# EAGLE design usbmass.1 (EAGLE 5.06)
PIN1: SCLK
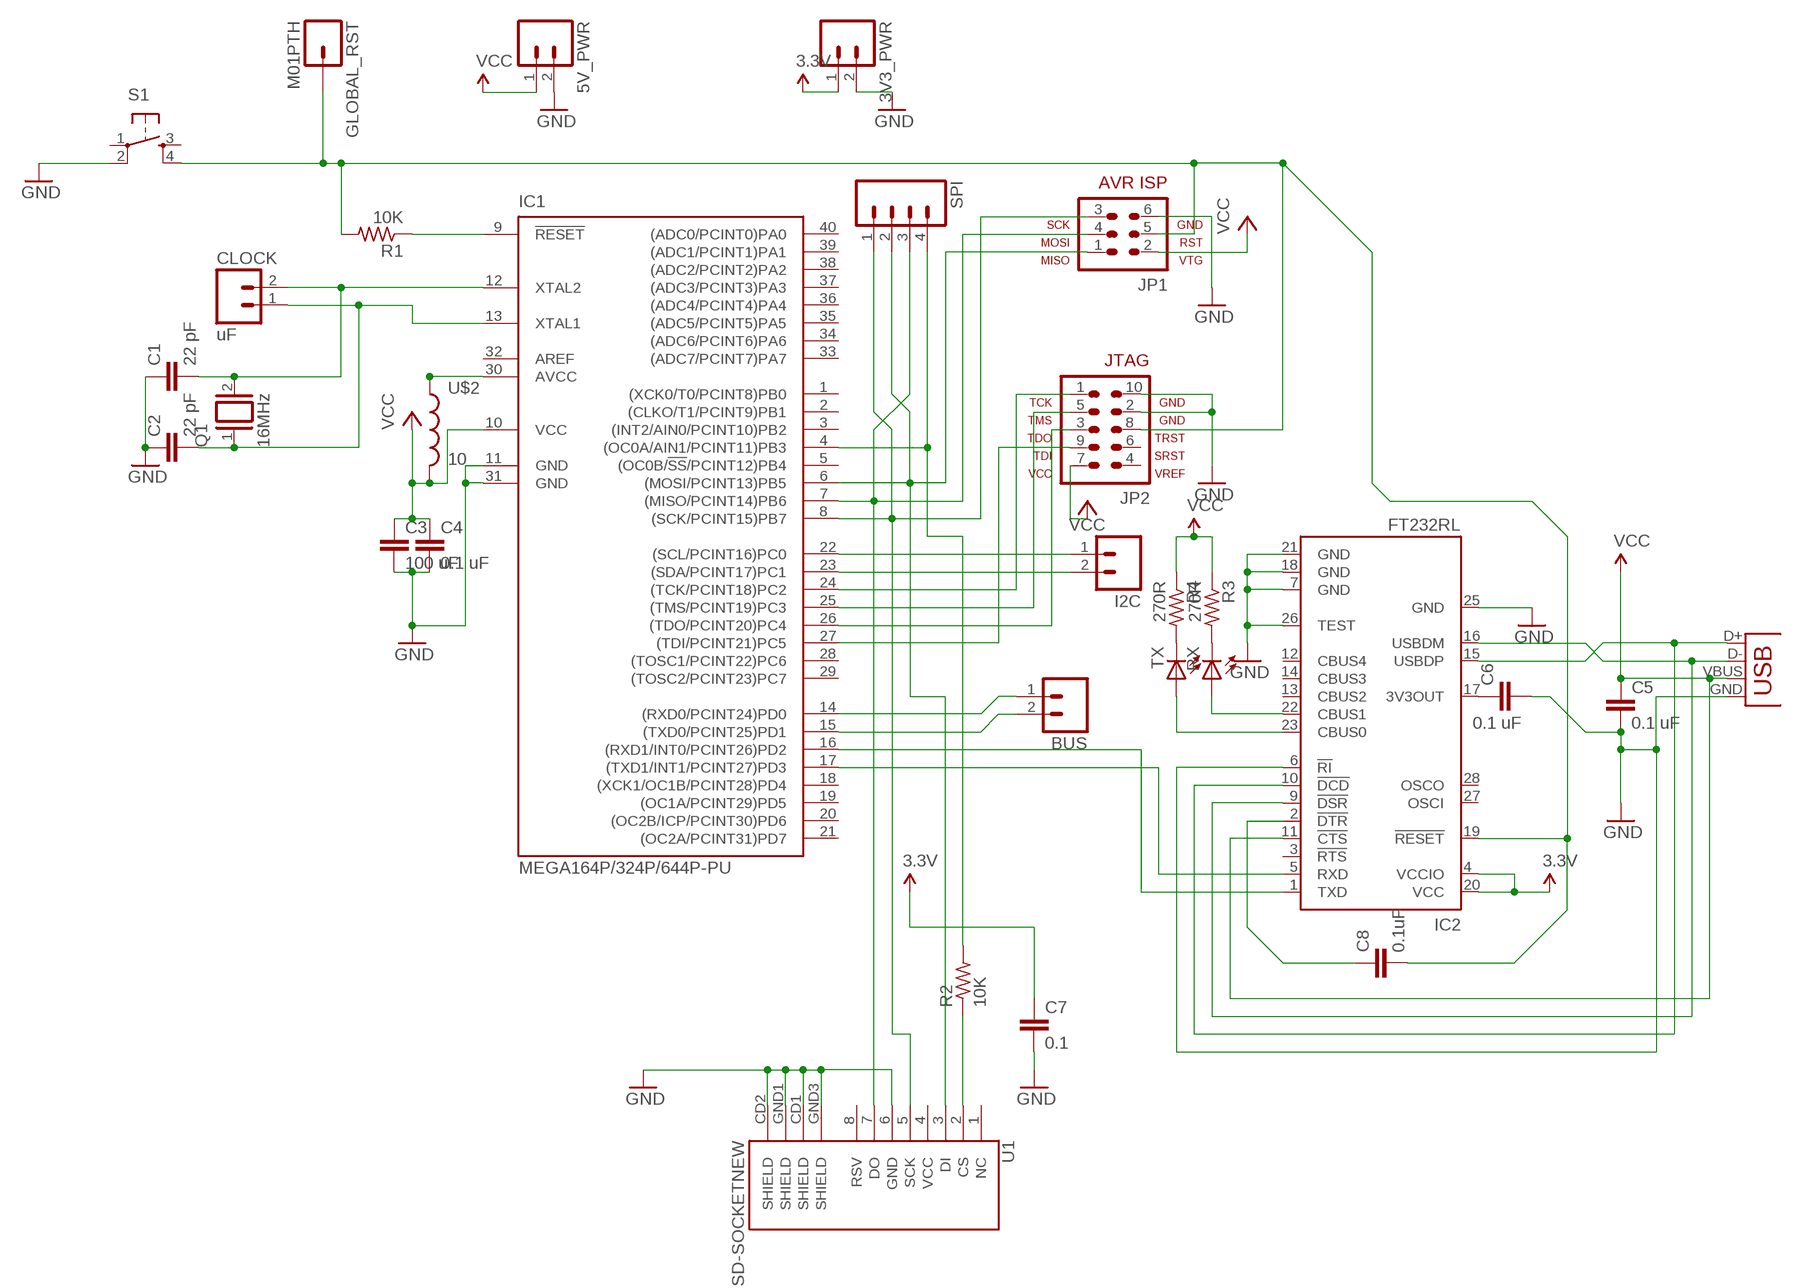
[diagram p0: schematic, sheet 1]

## Parts
3V3_PWR  M02  [1X02_LONGPADS]
5V_PWR  M02  [1X02_LONGPADS]
BUS  M02  [1X02_LONGPADS]
C1  22 pF  CAP0603-CAP  [0603-CAP]
C2  22 pF  CAP0603-CAP  [0603-CAP]
C3  100 uF  CAP0603-CAP  [0603-CAP]
C4  0.1 uF  CAP0603-CAP  [0603-CAP]
C5  0.1 uF  CAP0603-CAP  [0603-CAP]
C6  0.1 uF  CAP0603-CAP  [0603-CAP]
C7  0.1  CAP0603-CAP  [0603-CAP]
C8  0.1uF  CAP0603-CAP  [0603-CAP]
CLOCK  uF  M02PTH  [1X02]
GLOBAL_RST  M01PTH  [1X01]
I2C  M02LOCK  [1X02_LOCK]
IC1  MEGA164P/324P/644P-PU  [DIL40]
IC2  FT232RL  [SSOP28]
JP1  AVR-ISP-6  [AVR-ISP-6]
JP2  AVR-JTAG-10  [AVR-JTAG-10]
Q1  16MHz  XTAL  [Q]
R1  10K  R-US_R0603  [R0603]
R2  10K  R-US_R0603  [R0603]
R3  270R  R-US_R0603  [R0603]
R4  270R  R-US_R0603  [R0603]
RX  LED0603  [LED-0603]
S1  TAC_SWITCHSMD  [TACTILE_SWITCH_SMD]
SPI  M04LOCK  [1X04_LOCK]
TX  LED0603  [LED-0603]
U1  USD-SOCKETNEW  [MICRO-SD-SOCKET-PP]
U$2  10  INDUCTOR0603  [0603]
X1  USBSMD  [USB-MINIB]

## Nets
3.3V: 3V3_PWR.1 C7.1 IC2.4(VCCIO) IC2.20(VCC)
GND: 3V3_PWR.2 5V_PWR.2 C1.1 C2.1 C3.2 C4.2 C5.2 C6.2 C7.2 IC1.11(GND) IC1.31(GND) IC2.6(!RI) IC2.7(GND) IC2.18(GND) IC2.21(GND) IC2.25(GND) IC2.26(TEST) JP1.6 JP2.2 JP2.10 S1.2 U1.6(GND) U1.CD1(SHIELD) U1.CD2(SHIELD) U1.GND1(SHIELD) U1.GND3(SHIELD) X1.GND
N$1: IC1.9(!RESET) R1.1
N$2: C8.2 GLOBAL_RST.1 IC2.19(!RESET) JP1.5 JP2.8 R1.2 S1.4
N$3: C2.2 CLOCK.1 IC1.13(XTAL1) Q1.1
N$4: C1.2 CLOCK.2 IC1.12(XTAL2) Q1.2
N$5: IC1.30(AVCC) U$2.1
N$6: IC1.25((TMS/PCINT19)PC3) JP2.5
N$7: IC1.8((SCK/PCINT15)PB7) JP1.3 SPI.1 U1.5(SCK)
N$8: IC1.7((MISO/PCINT14)PB6) JP1.4 SPI.3 U1.7(DO)
N$9: IC1.6((MOSI/PCINT13)PB5) JP1.1 SPI.2 U1.3(DI)
N$10: IC1.26((TDO/PCINT20)PC4) JP2.3
N$11: IC1.24((TCK/PCINT18)PC2) JP2.1
N$12: IC1.17((TXD1/INT1/PCINT27)PD3) IC2.5(RXD)
N$13: IC1.27((TDI/PCINT21)PC5) JP2.9
N$14: I2C.2 IC1.23((SDA/PCINT17)PC1)
N$15: IC1.4((OC0A/AIN1/PCINT11)PB3) R2.2 SPI.4
N$16: C6.1 IC2.17(3V3OUT)
N$17: IC1.16((RXD1/INT0/PCINT26)PD2) IC2.1(TXD)
N$18: IC2.9(!DSR) IC2.16(USBDM) X1.D-
N$19: IC2.10(!DCD) IC2.15(USBDP) X1.D+
N$20: IC2.23(CBUS0) TX.A
N$21: R2.1 U1.2(CS)
N$22: R4.2 TX.C
N$23: R3.2 RX.C
N$24: IC2.22(CBUS1) RX.A
N$25: BUS.2 IC1.15((TXD0/PCINT25)PD1)
N$26: BUS.1 IC1.14((RXD0/PCINT24)PD0)
N$27: I2C.1 IC1.22((SCL/PCINT16)PC0)
N$30: C8.1 IC2.2(!DTR)
VCC: 5V_PWR.1 C3.1 C4.1 C5.1 IC1.10(VCC) IC2.11(!CTS) JP1.2 JP2.7 R3.1 R4.1 U$2.2 X1.VBUS
Unconnected: IC1.1((XCK0/T0/PCINT8)PB0) IC1.2((CLKO/T1/PCINT9)PB1) IC1.3((INT2/AIN0/PCINT10)PB2) IC1.5((OC0B/!SS!/PCINT12)PB4) IC1.18((XCK1/OC1B/PCINT28)PD4) IC1.19((OC1A/PCINT29)PD5) IC1.20((OC2B/ICP/PCINT30)PD6) IC1.21((OC2A/PCINT31)PD7) IC1.28((TOSC1/PCINT22)PC6) IC1.29((TOSC2/PCINT23)PC7) IC1.33((ADC7/PCINT7)PA7) IC1.34((ADC6/PCINT6)PA6) IC1.35((ADC5/PCINT5)PA5) IC1.36((ADC4/PCINT4)PA4) IC1.37((ADC3/PCINT3)PA3) IC1.38((ADC2/PCINT2)PA2) IC1.39((ADC1/PCINT1)PA1) IC1.40((ADC0/PCINT0)PA0) IC2.3(!RTS) IC2.12(CBUS4) IC2.13(CBUS2) IC2.14(CBUS3) IC2.27(OSCI) IC2.28(OSCO) JP2.4 JP2.6 S1.1 S1.3 U1.1(NC) U1.4(VCC) U1.8(RSV)

## Power pins joined to a net without a drawn wire
AREF: IC1.32(AREF)

## Library data of the parts
3V3_PWR 5V_PWR BUS CLOCK I2C = SparkFun:M02: Header 2 Standard 2-pin 0.1" header. Use with straight break away headers (SKU : PRT-00116), right angle break away headers (PRT-00553), swiss pins (PRT-00743), machine pins (PRT-00117), and female headers (PRT-00115). Molex polarized connector foot print use with SKU : PRT-08233 with associated crimp pins and housings.
C1-C8 = SparkFun:CAP: Capacitor Standard 0603 ceramic capacitor, and 0.1" leaded capacitor.
GLOBAL_RST = SparkFun:M01: Header 1 Standard 1-pin 0.1" header. Use with straight break away headers (SKU : PRT-00116), right angle break away headers (PRT-00553), swiss pins (PRT-00743), machine pins (PRT-00117), and female headers (PRT-00115).
IC1 = avr-6:MEGA164P/324P/644P-PU
IC2 = ftdichip:FT232R: Source: http://www.ftdichip.com/Documents/DataSheets/DS_FT232R_v104.pdf
JP1 = avr-6:AVR-ISP-6: AVR ISP-6 Serial Programming Header
JP2 = avr-6:AVR-JTAG-10: AVR JTAG Debug/Programming Header
Q1 = special:XTAL: CRYSTAL
R1-R4 = resistor:R-US_: RESISTOR, American symbol
RX TX = SparkFun:LED: LEDs Standard schematic elements and footprints for 5mm, 3mm, 1206, and 0603 sized LEDs. 5mm - Spark Fun Electronics SKU : COM-00529 (and others)
S1 = SparkFun:TAC_SWITCH: Momentary Switch Button commonly used for reset or general input. Spark Fun Electronics SKU : COM-00097
SPI = SparkFun:M04: Header 4 Standard 4-pin 0.1" header. Use with straight break away headers (SKU : PRT-00116), right angle break away headers (PRT-00553), swiss pins (PRT-00743), machine pins (PRT-00117), and female headers (PRT-00115). Molex polarized connector foot print use with SKU : PRT-08231 with associated crimp pins and housings.
U1 = SparkFun:USD-SOCKET: microSD Socket Push-push type uSD socket. Schematic element and footprint production proven. Spark Fun Electronics SKU : PRT-00127. tDoc lines correctly indicate media card edge positions when inserting (unlocked, locked, depressed).
U$2 = SparkFun:INDUCTOR: Inductors Basic Inductor/Choke - 0603 and 1206. Footprints are not proven and vary greatly between part numbers.
X1 = SparkFun:USB: USB Connectors USB-B-PTH is fully proven SKU : PRT-00139 USB-miniB is fully proven SKU : PRT-00587 USB-A-PCB is untested. USB-A-H is throughly reviewed, but untested. Spark Fun Electronics SKU : PRT-00437 USB-B-SMT is throughly reviewed, but untested. Needs silkscreen touching up. USB-A-S has not been used/tested USB-MB-H has not been used/tested

## Board
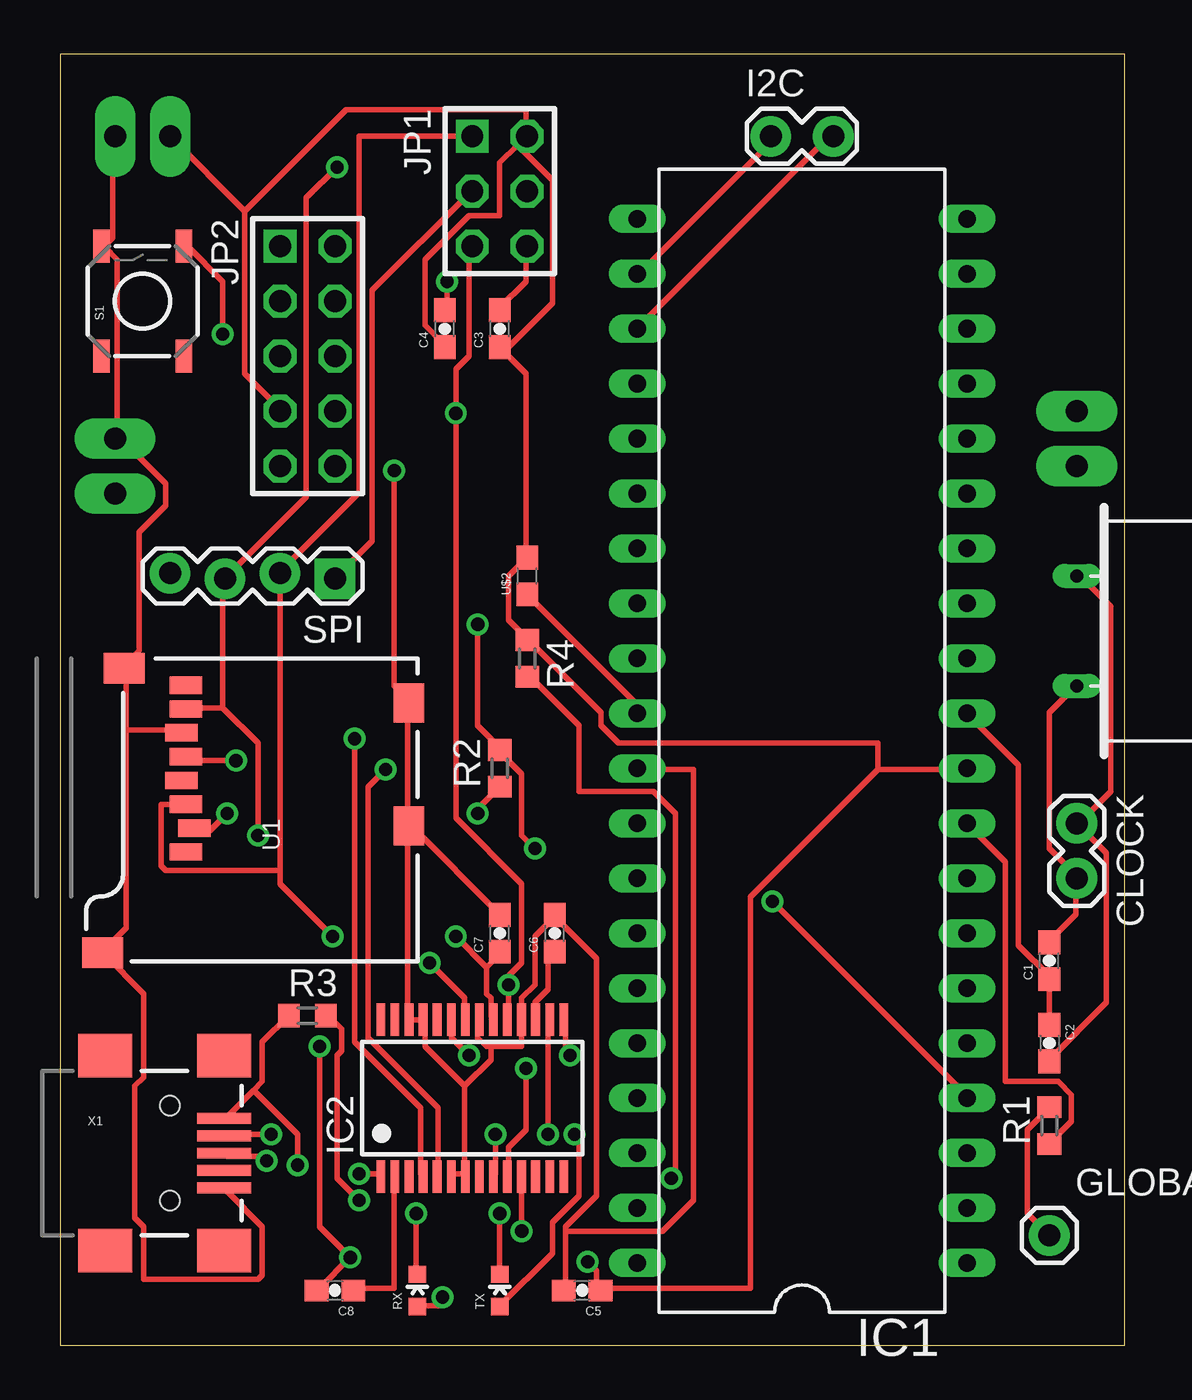
[diagram p1: board, top side]
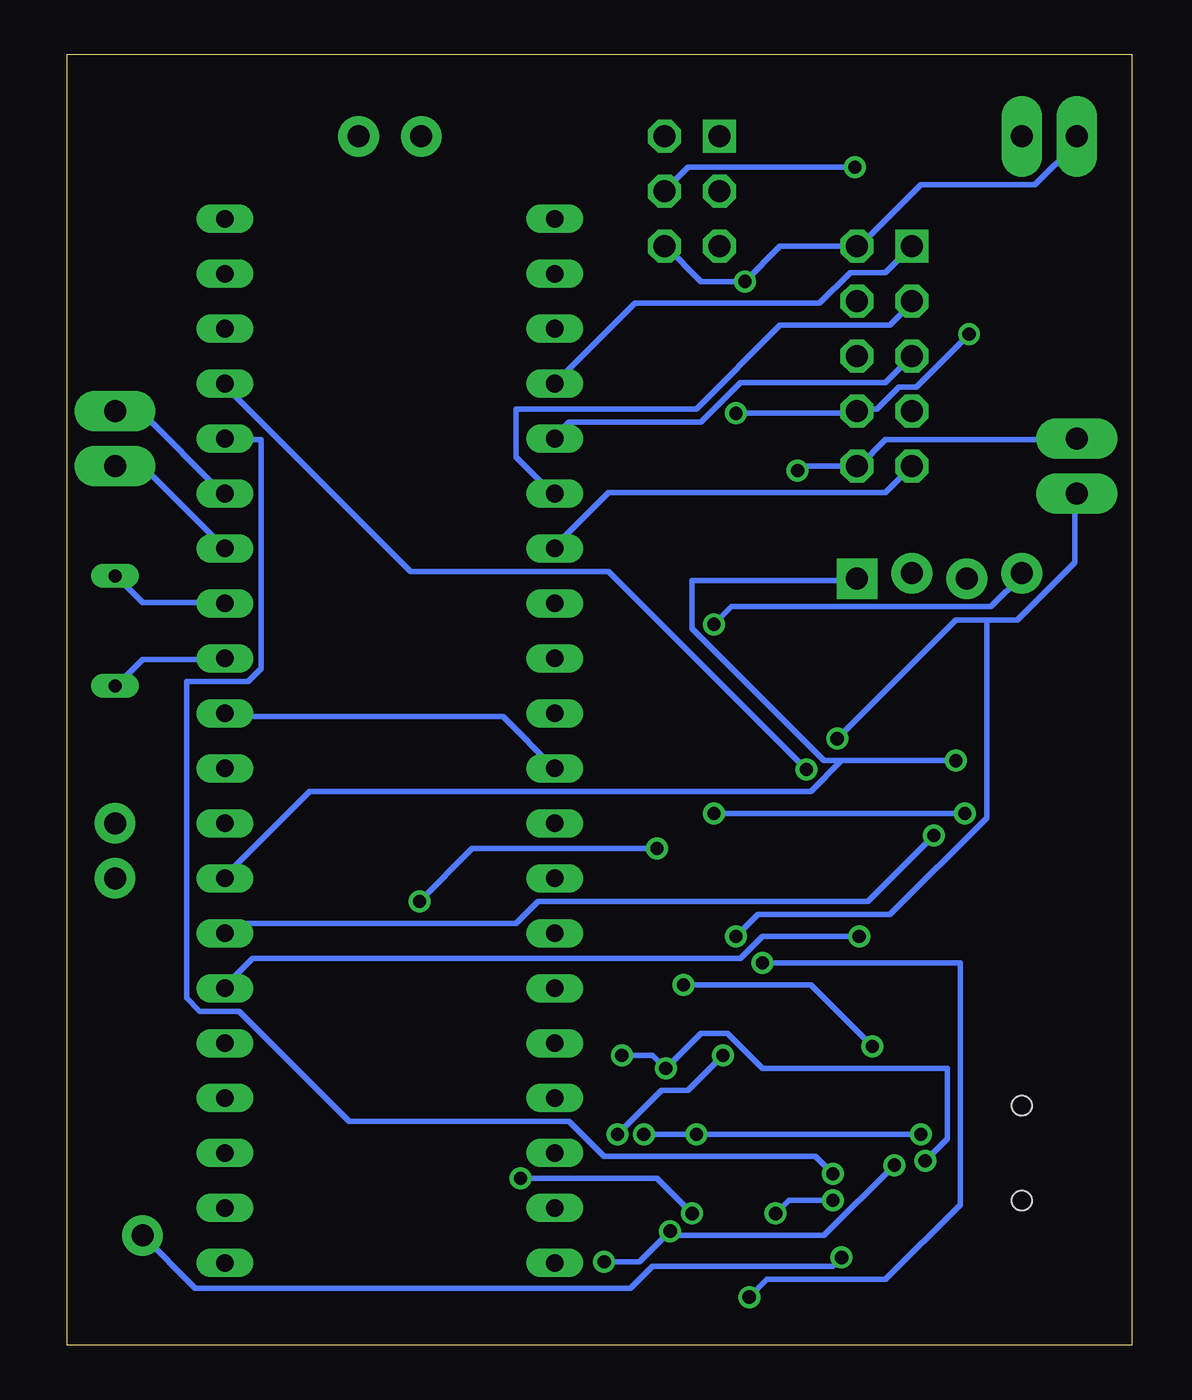
[diagram p2: board, bottom side, seen from below]

Size 49.2 x 59.68 mm. Coordinates in mm from the lower left corner, seen from the top.
Outline: 0,0 49.2,0 49.2,59.68 0,59.68 0,0
Copper layers (1*16): Top 0.035mm / dielectric 1.5mm / Bottom 0.035mm
Design rules "default": minimum track width 10mil, minimum drill 24mil, track to track 8mil, track to pad 8mil, pad to pad 8mil, via to via 8mil, smd to smd 8mil, copper to edge 40mil, drill to drill 8mil, minimum pad ring 10mil, minimum via ring 8mil, stop-mask expansion 4mil, vias tented up to drill 0mil, thermal gap 10mil

### Footprints (pad centres in the part's own frame; a part is rotated, then mirrored left to right if it is on the bottom)
1X02_LONGPADS = drill 1.016 pad 1.88 long: 1 0,0; 2 2.54,0
0603-CAP = smd 1.1 x 1: 1 -0.85,0; 2 0.85,0
1X02 = drill 1.016 pad 1.88 round: 1 0,0; 2 2.54,0
1X01 = drill 1.016 pad 1.88 round: 1 0,0
1X02_LOCK = drill 1.016 pad 1.88 round: 1 -0.178,0; 2 2.718,0
DIL40 = drill 0.813 long: 1 -24.13,-7.62; 2 -21.59,-7.62; 3 -19.05,-7.62; 4 -16.51,-7.62; 5 -13.97,-7.62; 6 -11.43,-7.62; 7 -8.89,-7.62; 8 -6.35,-7.62; 9 -3.81,-7.62; 10 -1.27,-7.62; 11 1.27,-7.62; 12 3.81,-7.62; 13 6.35,-7.62; 14 8.89,-7.62; 15 11.43,-7.62; 16 13.97,-7.62; 17 16.51,-7.62; 18 19.05,-7.62; 19 21.59,-7.62; 20 24.13,-7.62; 21 24.13,7.62; 22 21.59,7.62; 23 19.05,7.62; 24 16.51,7.62; 25 13.97,7.62; 26 11.43,7.62; 27 8.89,7.62; 28 6.35,7.62; 29 3.81,7.62; 30 1.27,7.62; 31 -1.27,7.62; 32 -3.81,7.62; 33 -6.35,7.62; 34 -8.89,7.62; 35 -11.43,7.62; 36 -13.97,7.62; 37 -16.51,7.62; 38 -19.05,7.62; 39 -21.59,7.62; 40 -24.13,7.62
SSOP28 = smd 0.4 x 1.5: 1 -4.225,-3.625; 2 -3.575,-3.625; 3 -2.925,-3.625; 4 -2.275,-3.625; 5 -1.625,-3.625; 6 -0.975,-3.625; 7 -0.325,-3.625; 8 0.325,-3.625; 9 0.975,-3.625; 10 1.625,-3.625; 11 2.275,-3.625; 12 2.925,-3.625; 13 3.575,-3.625; 14 4.225,-3.625; 15 4.225,3.625; 16 3.575,3.625; 17 2.925,3.625; 18 2.275,3.625; 19 1.625,3.625; 20 0.975,3.625; 21 0.325,3.625; 22 -0.325,3.625; 23 -0.975,3.625; 24 -1.625,3.625; 25 -2.275,3.625; 26 -2.925,3.625; 27 -3.575,3.625; 28 -4.225,3.625
AVR-ISP-6 = drill 1.016 square: 1 -2.54,-1.27 | drill 1.016 octagon: 2 -2.54,1.27; 3 0,-1.27; 4 0,1.27; 5 2.54,-1.27; 6 2.54,1.27
AVR-JTAG-10 = drill 1.016 square: 1 -5.08,-1.27 | drill 1.016 octagon: 2 -5.08,1.27; 3 -2.54,-1.27; 4 -2.54,1.27; 5 0,-1.27; 6 0,1.27; 7 2.54,-1.27; 8 2.54,1.27; 9 5.08,-1.27; 10 5.08,1.27
Q = drill 0.61 long: 1 -2.54,-7.62; 2 2.54,-7.62
R0603 = smd 1 x 1.1: 1 -0.85,0; 2 0.85,0
LED-0603 = smd 0.8 x 0.8: A 0,-0.75; C 0,0.75
TACTILE_SWITCH_SMD = smd 1.524 x 0.762: 1 -2.54,1.905; 2 2.54,1.905; 3 -2.54,-1.905; 4 2.54,-1.905
1X04_LOCK = drill 1.016 pad 1.88 square: 1 0,0.127 | drill 1.016 pad 1.88 round: 2 2.54,-0.127; 3 5.08,0.127; 4 7.62,-0.127
MICRO-SD-SOCKET-PP = smd 0.8 x 1.5: 1 -8.94,10.7; 2 -7.84,10.3; 3 -6.74,10.7; 4 -5.64,10.9; 5 -4.54,10.7; 6 -3.44,10.9; 7 -2.34,10.7; 8 -1.24,10.7 | smd 1.8 x 1.4: CD1 -2.05,0.4; CD2 -7.75,0.4 | smd 1.4 x 1.9: GND1 -13.6,14.55; GND3 -0.45,13.55
0603 = smd 1.1 x 1: 1 -0.85,0; 2 0.85,0
USB-MINIB = smd 2.5 x 0.5: D+ 2.5,0; D- 2.5,0.8; GND 2.5,-1.6; ID 2.5,-0.8; VBUS 2.5,1.6 | smd 2.5 x 2: GND@1 -3,-4.5; GND@2 -3,4.5; GND@3 2.5,4.5; GND@4 2.5,-4.5 | hole 0.9: 0,2.2; 0,-2.2

### Placement (x,y rotation side)
3V3_PWR  2.54,39.37 90 top
5V_PWR  5.08,55.88 180 top
BUS  46.99,40.64 90 top
C1  45.72,17.78 90 top
C2  45.72,13.97 270 top
C3  20.32,46.99 90 top
C4  17.78,46.99 90 top
C5  24.13,2.54 180 top
C6  22.86,19.05 90 top
C7  20.32,19.05 90 top
C8  12.7,2.54 180 top
CLOCK  46.99,24.13 270 top
GLOBAL_RST  45.72,5.08 0 top
I2C  33.02,55.88 0 top
IC1  34.29,27.94 90 top
IC2  19.05,11.43 0 top
JP1  20.32,53.34 270 top
JP2  11.43,45.72 270 top
Q1  54.61,33.02 270 top
R1  45.72,10.16 90 top
R2  20.32,26.67 90 top
R3  11.43,15.24 0 top
R4  21.59,31.75 270 top
RX  16.51,2.54 0 top
S1  3.81,48.26 90 top
SPI  12.7,35.56 180 top
TX  20.32,2.54 0 top
U1  16.51,31.75 90 top
U$2  21.59,35.56 90 top
X1  5.08,8.89 0 top

### Tracks (layer width: path | path; a pad name or v marks a point on that pad's centre or on a via)
3.3V  (via drill 0.61)
  Top 0.254: 19.71,17.48 20.32,18.09 C7.1 | 19.71,17.48 19.71,16.26 19.91,16.05 19.91,15.24 IC2.20 | v13.61,28.04 13.61,14.02 16.66,10.97 16.66,7.92 IC2.4 | v18.29,18.9 19.71,17.48
  Bottom 0.254: v13.61,28.04 8.13,33.53 6.71,33.53 | 6.71,33.53 5.28,33.53 2.64,36.17 2.64,39.22 3V3_PWR.1 | v18.29,18.9 17.27,19.91 11.18,19.91 6.71,24.38 6.71,33.53
GND  (via drill 0.61)
  Top 0.254: C2.1 C1.1 45.72,17.07 44.3,18.49 44.3,26.82 IC1.11 | C7.2 20.32,19.91 16.26,23.98 U1.CD2 | U1.CD2 16.05,23.98 16.05,15.24 IC2.26 16.26,15.04 16.66,15.04 IC2.25 16.87,15.04 16.87,13.82 18.69,11.99 | U1.CD2 16.05,24.18 16.05,29.67 U1.CD1 16.05,29.87 15.44,30.48 v15.44,40.44 | 18.69,7.92 18.09,7.92 IC2.6 | 23.37,5.28 23.37,5.49 24.79,6.91 24.79,17.88 22.96,19.71 C6.2 22.76,19.71 21.95,18.9 21.95,16.66 21.34,16.05 21.34,15.24 IC2.18 21.34,15.04 21.34,13.82 19.91,13.82 | 23.37,5.28 23.37,2.64 C5.2 | 19.91,13.82 19.71,13.82 19.3,14.22 19.3,15.04 IC2.21 | 18.69,11.99 18.69,7.92 | 18.69,11.99 19.91,13.21 19.91,13.82 | 18.69,7.92 IC2.7 | 23.37,5.28 27.84,5.28 29.26,6.71 29.26,26.62 26.82,26.62 IC1.31 | 3.05,28.45 5.49,28.45 U1.6 | 3.05,28.45 3.05,31.29 U1.GND3 3.05,31.5 3.66,32.11 3.66,37.59 4.88,38.81 4.88,39.83 2.64,42.06 | 3.05,28.45 3.05,19.3 2.03,18.29 U1.GND1 2.03,18.09 3.86,16.26 3.86,12.39 3.45,11.99 3.45,5.89 3.86,5.49 3.86,3.05 9.14,3.05 9.35,3.25 9.35,5.49 7.72,7.11 X1.GND | C3.2 20.32,47.95 21.54,49.17 21.54,50.8 JP1.6 | v17.88,49.17 17.88,47.95 C4.2 | 2.03,50.8 2.44,51.21 2.44,55.88 5V_PWR.2 | 2.03,50.8 2.64,50.19 2.64,42.06 | 2.03,50.8 S1.2 | 2.64,42.06 3V3_PWR.2
  Bottom 0.254: IC1.31 29.06,29.06 41.86,29.06 IC1.11 | JP1.6 21.54,50.8 19.91,49.17 v17.88,49.17 16.26,50.8 JP2.2 12.6,50.8 9.75,53.65 4.47,53.65 2.64,55.47 2.64,55.88 5V_PWR.2 | 3V3_PWR.2 2.64,41.86 11.38,41.86 12.6,40.64 JP2.10 15.24,40.64 v15.44,40.44
N$1
  Top 0.254: R1.1 45.72,9.35 46.74,10.36 46.74,11.58 46.13,12.19 43.69,12.19 43.69,22.35 IC1.9
N$2  (via drill 0.61)
  Top 0.254: C8.2 11.99,2.64 v13.41,4.06 11.99,5.49 v11.99,13.82 | GLOBAL_RST.1 44.7,6.1 44.7,9.96 45.72,10.97 R1.2 | v7.52,46.74 7.52,49.17 5.89,50.8 S1.4 | IC2.19 20.73,15.24 v20.73,16.66 20.73,17.07 21.34,17.68 21.34,21.34 18.29,24.38 v18.29,43.08 18.29,45.11 18.9,45.72 18.9,50.8 JP1.5
  Bottom 0.254: v13.41,4.06 13.82,3.66 22.15,3.66 23.16,2.64 43.28,2.64 GLOBAL_RST.1 | v7.52,46.74 9.96,44.3 10.77,44.3 11.79,43.28 12.6,43.28 JP2.8 12.8,43.08 v18.29,43.08 | v11.99,13.82 14.83,16.66 v20.73,16.66
N$3
  Top 0.254: C2.2 45.72,13.21 48.36,15.85 48.36,22.76 CLOCK.1 47.14,24.18 48.56,25.6 48.56,34.14 47.14,35.56 Q1.1
  Bottom 0.254: Q1.1 46.94,35.56 45.72,34.34 42.06,34.34 IC1.13
N$4
  Top 0.254: C1.2 45.72,18.69 46.94,19.91 46.94,21.54 CLOCK.2 46.94,21.74 45.72,22.96 45.72,29.26 46.94,30.48 Q1.2
  Bottom 0.254: Q1.2 46.94,30.48 45.72,31.7 42.06,31.7 IC1.12
N$5
  Top 0.254: U$2.1 21.74,34.54 26.62,29.67 26.62,29.26 IC1.30
N$6
  Bottom 0.254: JP2.5 11.38,44.5 18.09,44.5 19.91,42.67 26.01,42.67 26.62,42.06 IC1.25
N$7  (via drill 0.61)
  Top 0.254: v8.13,27.03 5.89,27.03 U1.5 | JP1.3 18.9,53.24 14.43,48.77 14.43,37.19 12.8,35.56 SPI.1
  Bottom 0.254: 13.41,27.03 14.22,27.03 20.32,33.12 20.32,35.36 12.8,35.36 SPI.1 | v8.13,27.03 13.41,27.03 | 13.41,27.03 14.83,25.6 38,25.6 41.86,21.74 IC1.8
N$8  (via drill 0.61)
  Top 0.254: 7.52,29.46 5.89,29.46 U1.7 | 7.52,29.46 7.52,35.36 SPI.3 7.72,35.56 11.38,39.22 11.38,53.03 v12.8,54.46 | v9.14,23.57 9.14,27.84 7.52,29.46
  Bottom 0.254: v9.14,23.57 12.19,20.52 27.43,20.52 28.45,19.51 41.45,19.51 IC1.7 | v12.8,54.46 20.52,54.46 21.54,53.44 JP1.4
N$9  (via drill 0.61)
  Top 0.254: 10.16,21.95 4.88,21.95 4.67,22.15 4.67,24.99 5.69,24.99 U1.3 | 10.16,21.95 SPI.2 10.16,35.76 13.82,39.42 13.82,55.88 JP1.1 | v12.6,18.9 10.16,21.34 10.16,21.95
  Bottom 0.254: v12.6,18.9 17.07,18.9 18.09,17.88 40.64,17.88 41.86,16.66 IC1.6
N$10
  Bottom 0.254: IC1.26 26.82,39.42 28.45,41.05 28.45,43.28 20.12,43.28 16.26,47.14 11.18,47.14 10.16,48.16 JP2.3
N$11
  Bottom 0.254: JP2.1 11.38,49.58 13.01,49.58 14.43,48.16 22.96,48.16 IC1.24
N$12  (via drill 0.61)
  Top 0.254: v15.04,26.62 14.22,25.81 14.22,14.22 17.48,10.97 17.48,7.92 IC2.5
  Bottom 0.254: v15.04,26.62 24.18,35.76 33.33,35.76 41.86,44.3 IC1.17
N$13
  Bottom 0.254: JP2.9 11.38,39.42 24.18,39.42 26.62,36.98 IC1.27
N$14
  Top 0.254: IC1.23 35.56,55.88 I2C.2
N$15  (via drill 0.61)
  Top 0.254: v19.3,33.33 19.3,28.65 20.32,27.64 R2.2 20.32,27.43 21.34,26.42 21.34,23.57 v21.95,22.96 | v32.92,20.52 41.86,11.58 IC1.4
  Bottom 0.254: v19.3,33.33 18.49,34.14 6.5,34.14 5.08,35.56 SPI.4 | v32.92,20.52 30.48,22.96 v21.95,22.96
N$16
  Top 0.254: C6.1 22.76,18.09 22.55,17.88 22.55,16.46 21.95,15.85 21.95,15.24 IC2.17
N$17  (via drill 0.61)
  Top 0.254: v13.82,7.92 14.63,7.92 IC2.1
  Bottom 0.254: v13.82,7.92 14.63,8.74 24.38,8.74 26.01,10.36 36.17,10.36 41.25,15.44 43.08,15.44 43.69,16.05 43.69,30.68 40.84,30.68 40.23,31.29 40.23,41.86 41.86,41.86 IC1.16
N$18  (via drill 0.61)
  Top 0.254: v20.12,9.75 20.12,7.92 IC2.9 | v22.55,9.75 22.55,15.04 IC2.16 | v9.75,9.75 7.72,9.75 X1.D-
  Bottom 0.254: v22.55,9.75 v20.12,9.75 v9.75,9.75
N$19  (via drill 0.61)
  Top 0.254: v21.54,12.8 21.54,9.96 20.73,9.14 20.73,7.92 IC2.10 | v23.57,13.41 23.37,13.61 23.37,15.04 IC2.15 | v9.55,8.53 9.55,8.74 7.72,8.74 X1.D+
  Bottom 0.254: v23.57,13.41 22.15,13.41 v21.54,12.8 19.91,14.43 18.69,14.43 17.07,12.8 8.53,12.8 8.53,9.55 v9.55,8.53
N$20  (via drill 0.61)
  Top 0.254: v23.77,9.75 23.98,9.55 23.98,6.91 22.76,5.69 22.76,4.27 20.32,1.83 TX.A | v18.9,13.41 18.09,14.22 18.09,15.04 IC2.23
  Bottom 0.254: v23.77,9.75 21.74,11.79 20.52,11.79 v18.9,13.41
N$21  (via drill 0.61)
  Top 0.254: v19.3,24.59 19.3,24.79 20.32,25.81 R2.1 | v7.72,24.59 6.91,23.77 6.3,23.77 U1.2
  Bottom 0.254: v7.72,24.59 v19.3,24.59
N$22  (via drill 0.61)
  Top 0.254: v28.25,7.72 28.45,7.92 28.45,24.59 27.43,25.6 23.98,25.6 23.98,28.65 21.74,30.89 R4.2 | TX.C v20.32,6.1
  Bottom 0.254: v20.32,6.1 21.95,7.72 v28.25,7.72
N$23  (via drill 0.61)
  Top 0.254: v16.46,6.1 16.46,3.45 RX.C | v13.82,6.71 12.8,7.72 12.8,13.41 13.01,13.61 13.01,14.63 12.39,15.24 R3.2
  Bottom 0.254: v16.46,6.1 15.85,6.71 v13.82,6.71
N$24  (via drill 0.61)
  Top 0.254: v17.68,2.23 17.68,1.83 16.66,1.83 RX.A | v17.07,17.68 18.69,16.05 18.69,15.24 IC2.22
  Bottom 0.254: v17.68,2.23 16.87,3.05 11.38,3.05 7.92,6.5 7.92,17.68 v17.07,17.68
N$25
  Bottom 0.254: IC1.15 42.06,39.42 45.72,43.08 46.94,43.08 BUS.2
N$26
  Bottom 0.254: IC1.14 45.72,40.64 BUS.1
N$27
  Top 0.254: IC1.22 26.82,49.58 32.72,55.47 32.72,55.88 I2C.1
N$30
  Top 0.254: C8.1 13.61,2.64 15.44,2.64 15.44,7.72 IC2.2
VCC  (via drill 0.61)
  Top 0.254: 8.53,52.43 8.53,44.91 10.16,43.28 JP2.7 | 8.53,52.43 5V_PWR.1 | 20.52,45.92 21.54,44.91 21.54,36.58 U$2.2 21.54,36.37 20.73,35.56 20.73,33.53 21.54,32.72 R4.1 21.74,32.51 24.99,29.26 24.99,28.65 25.81,27.84 37.8,27.84 37.8,26.62 | 20.52,45.92 20.32,46.13 C3.1 20.52,45.92 | 21.13,55.47 21.54,55.88 | 21.13,55.47 20.32,54.66 20.32,52.22 18.9,52.22 16.87,50.19 16.87,47.14 17.68,46.33 C4.1 | 20.52,45.92 22.76,48.16 22.76,53.85 21.13,55.47 | 21.13,55.47 JP1.2 21.54,55.88 | 8.53,52.43 13.21,57.1 21.54,57.1 21.54,55.88 | 8.94,11.79 7.72,10.57 X1.VBUS | 8.94,11.79 9.35,12.19 9.35,14.02 10.57,15.24 R3.1 | 37.8,26.62 31.9,20.73 31.9,2.64 24.99,2.64 C5.1 24.79,2.64 24.79,3.45 v24.38,3.86 | 37.8,26.62 41.86,26.62 IC1.10 | v21.34,5.28 21.34,7.72 IC2.11 | 8.94,11.79 10.97,9.75 v10.97,8.33
  Bottom 0.254: 21.54,5.08 22.76,3.86 v24.38,3.86 | v10.97,8.33 14.22,5.08 21.54,5.08 | 21.54,5.08 v21.34,5.28